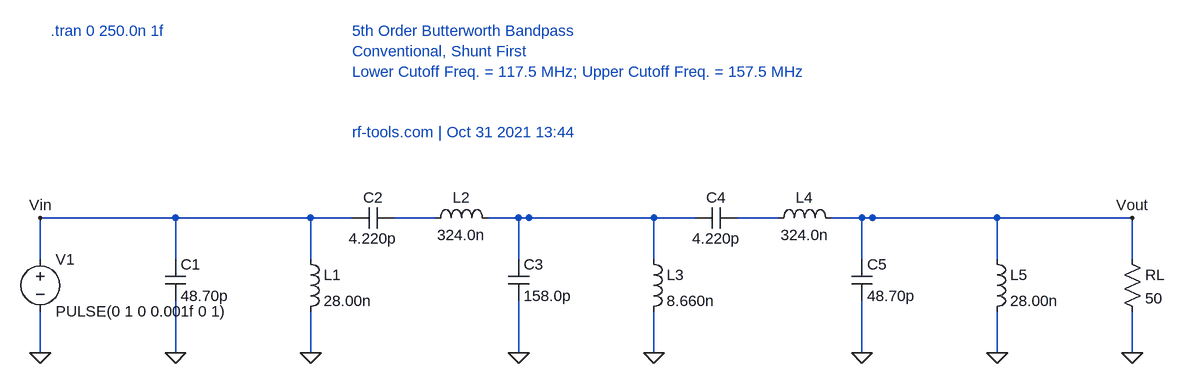
[diagram p0: schematic Butterworth-Bandpass.asc]
Butterworth-Bandpass.asc, the LTspice schematic file:
Version 4
SHEET 1 1200 400
WIRE 0 0 0 64
WIRE 0 144 0 208
WIRE 0 0 208 0
WIRE 208 0 208 64
WIRE 208 128 208 208
WIRE 208 0 416 0
WIRE 416 0 416 64
WIRE 416 144 416 208
WIRE 416 0 480 0
WIRE 544 0 608 0
WIRE 688 0 752 0
WIRE 736 0 736 64
WIRE 736 128 736 208
WIRE 736 0 944 0
WIRE 944 0 944 64
WIRE 944 144 944 208
WIRE 944 0 1008 0
WIRE 1072 0 1136 0
WIRE 1216 0 1280 0
WIRE 1264 0 1264 64
WIRE 1264 128 1264 208
WIRE 1264 0 1472 0
WIRE 1472 0 1472 64
WIRE 1472 144 1472 208
WIRE 1472 0 1680 0
WIRE 1680 0 1680 64
WIRE 1680 144 1680 208
FLAG 0 0 Vin
FLAG 0 208 0
FLAG 208 208 0
FLAG 416 208 0
FLAG 736 208 0
FLAG 944 208 0
FLAG 1264 208 0
FLAG 1472 208 0
FLAG 1680 208 0
FLAG 1680 0 Vout
SYMBOL voltage 0 48 R0
WINDOW 123 40 48 Left 2
WINDOW 39 39 77 Left 2
SYMATTR InstName V1
SYMATTR Value PULSE(0 1 0 0.001f 0 1)
SYMBOL cap 192 64 R0
SYMATTR InstName C1
SYMATTR Value 48.70p
SYMBOL ind 400 48 R0
SYMATTR InstName L1
SYMATTR Value 28.00n
SYMBOL cap 480 16 R270
SYMATTR InstName C2
SYMATTR Value 4.220p
WINDOW 0 32 32 VTop 2
WINDOW 3 0 32 VBottom 2
SYMBOL ind 592 16 R270
SYMATTR InstName L2
SYMATTR Value 324.0n
WINDOW 0 32 56 VTop 2
WINDOW 3 5 56 VBottom 2
SYMBOL cap 720 64 R0
SYMATTR InstName C3
SYMATTR Value 158.0p
SYMBOL ind 928 48 R0
SYMATTR InstName L3
SYMATTR Value 8.660n
SYMBOL cap 1008 16 R270
SYMATTR InstName C4
SYMATTR Value 4.220p
WINDOW 0 32 32 VTop 2
WINDOW 3 0 32 VBottom 2
SYMBOL ind 1120 16 R270
SYMATTR InstName L4
SYMATTR Value 324.0n
WINDOW 0 32 56 VTop 2
WINDOW 3 5 56 VBottom 2
SYMBOL cap 1248 64 R0
SYMATTR InstName C5
SYMATTR Value 48.70p
SYMBOL ind 1456 48 R0
SYMATTR InstName L5
SYMATTR Value 28.00n
SYMBOL res 1664 48 R0
SYMATTR InstName RL
SYMATTR Value 50
TEXT 16 -288 Left 2 .tran 0 250.0n 1f
TEXT 480 -288 Left 2 ;5th Order Butterworth Bandpass\nConventional, Shunt First\nLower Cutoff Freq. = 117.5 MHz; Upper Cutoff Freq. = 157.5 MHz\n\n\nrf-tools.com | Oct 31 2021 13:44

The netlist it stands for:
* Butterworth-Bandpass.asc
V1 Vin 0 PULSE(0 1 0 0.001f 0 1)
C1 Vin 0 48.70p
L1 Vin 0 28.00n
C2 Vin N001 4.220p
L2 N001 N002 324.0n
C3 N002 0 158.0p
L3 N002 0 8.660n
C4 N002 N003 4.220p
L4 N003 Vout 324.0n
C5 Vout 0 48.70p
L5 Vout 0 28.00n
RL Vout 0 50
* .tran 0 250.0n 1f
* 5th Order Butterworth Bandpass
* Conventional, Shunt First
* Lower Cutoff Freq. = 117.5 MHz; Upper Cutoff Freq. = 157.5 MHz
* rf-tools.com | Oct 31 2021 13:44
.backanno
.end